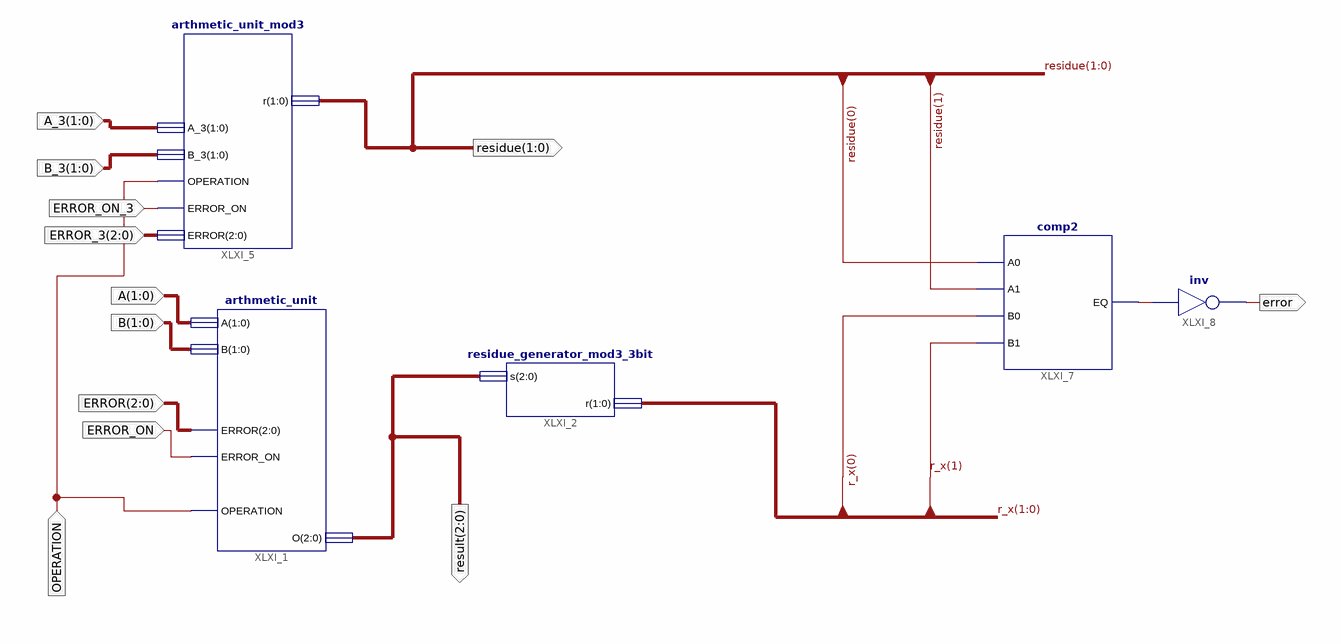
[diagram p0: schematic sheet 1]
// Xilinx ISE schematic system_error_detection.sch (spartan3e) as structural Verilog: 5 symbols, 12 ports
module system_error_detection (
  input  [1:0] A_3,
  input  [1:0] B_3,
  input  [1:0] A,
  input  [1:0] B,
  input  ERROR_ON,
  input  [2:0] error,
  input  OPERATION,
  input  ERROR_ON_3,
  input  [2:0] ERROR_3,
  output [1:0] residue,
  output error_1bit,
  output [2:0] result
);

  wire XLXN_23;
  wire [1:0] r_x;

  arthmetic_unit XLXI_1 (.A(A), .B(B), .OPERATION(OPERATION), .ERROR_ON(ERROR_ON), .ERROR(error), .O(result));
  residue_generator_mod3_3bit XLXI_2 (.s(result), .r(r_x));
  arthmetic_unit_mod3 XLXI_5 (
    .A_3(A_3), .B_3(B_3), .OPERATION(OPERATION), .r(residue), .ERROR_ON(ERROR_ON_3), .ERROR(ERROR_3));
  comp2 XLXI_7 (.A0(residue[0]), .A1(residue[1]), .B0(r_x[0]), .B1(r_x[1]), .EQ(XLXN_23));
  not XLXI_8 (error_1bit, XLXN_23);
endmodule
